# EAGLE design BME280_Breakout (EAGLE 7.1.0)
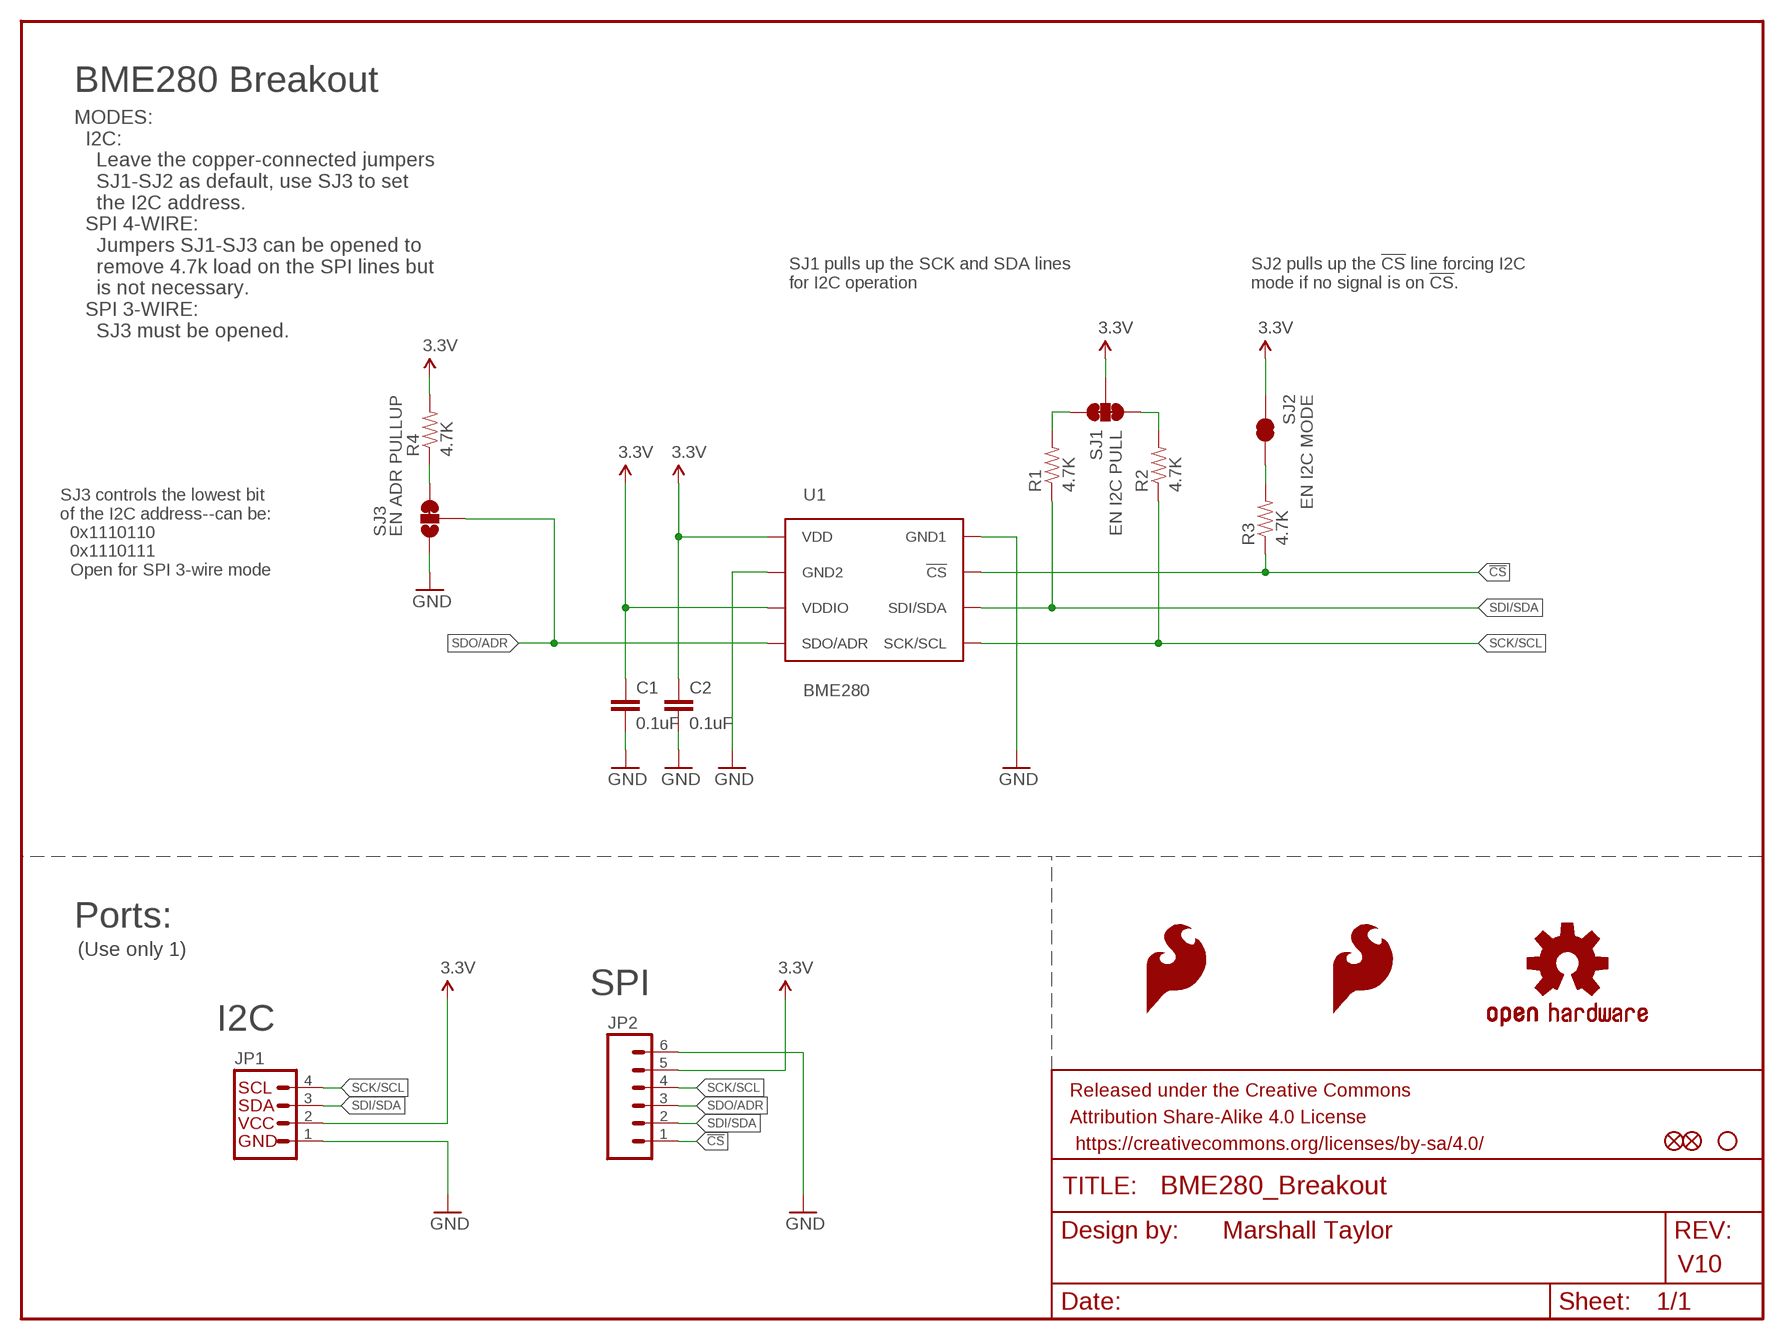
[diagram p0: schematic, sheet 1]

## Parts
C1  0.1uF  0.1UF-25V-5%(0603)  [0603-CAP]
C2  0.1uF  0.1UF-25V-5%(0603)  [0603-CAP]
FID1  FIDUCIAL1X2  [FIDUCIAL-1X2]
FID2  FIDUCIAL1X2  [FIDUCIAL-1X2]
FRAME1  FRAME-LETTER  [CREATIVE_COMMONS]
JP1  I2C_STANDARD_NO_SILK  [1X04_NO_SILK]
JP2  M06NO_SILK_FEMALE_PTH  [1X06_NO_SILK]
LOGO1  SFE_LOGO_FLAME.1_INCH  [SFE_LOGO_FLAME_.1]
LOGO2  SFE_LOGO_FLAME.1_INCH  [SFE_LOGO_FLAME_.1]
LOGO3  OSHW-LOGOS  [OSHW-LOGO-S]
R1  4.7K  4.7KOHM-1/10W-1%(0603)  [0603-RES]
R2  4.7K  4.7KOHM-1/10W-1%(0603)  [0603-RES]
R3  4.7K  4.7KOHM-1/10W-1%(0603)  [0603-RES]
R4  4.7K  4.7KOHM-1/10W-1%(0603)  [0603-RES]
SJ1  EN I2C PULL  JUMPER-PAD-3-NC_BY_TRACE  [PAD-JUMPER-3-3OF3_NC_BY_TRACE_YES_SILK_FULL_BOX]
SJ2  EN I2C MODE  JUMPER-PAD-2-NC_BY_TRACE  [PAD-JUMPER-2-NC_BY_TRACE_YES_SILK]
SJ3  EN ADR PULLUP  JUMPER-PAD-3-2OF3_NC_BY_TRACE_SMALL  [PAD-JUMPER-3-2OF3_NC_BY_TRACE_YES_SILK_FULL_BOX]
STANDOFF4  STAND-OFF  [STAND-OFF]
U1  BME280  [BME280_LGA]

## Nets
3.3V: C1.1 C2.1 JP1.2 JP2.5 R4.2 SJ1.2 SJ2.2 U1.P$6(VDDIO) U1.P$8(VDD)
!CS: JP2.1 R3.1 U1.P$2(!CS)
GND: C1.2 C2.2 JP1.1 JP2.6 SJ3.1 U1.P$1(GND1) U1.P$7(GND2)
N$1: R1.2 SJ1.3
N$2: R2.2 SJ1.1
N$3: R3.2 SJ2.1
N$4: R4.1 SJ3.3
SCK/SCL: JP1.4 JP2.4 R2.1 U1.P$4(SCK/SCL)
SDI/SDA: JP1.3 JP2.2 R1.1 U1.P$3(SDI/SDA)
SDO/ADR: JP2.3 SJ3.2 U1.P$5(SDO/ADR)

## Notes on the sheet
- BME280 Breakout
- MODES:
    I2C:
      Leave the copper-connected jumpers
      SJ1-SJ2 as default, use SJ3 to set
      the I2C address.
    SPI 4-WIRE:
      Jumpers SJ1-SJ3 can be opened to 
      remove 4.7k load on the SPI lines but
      is not necessary.
    SPI 3-WIRE:
      SJ3 must be opened.
- SJ1 pulls up the SCK and SDA lines
  for I2C operation
- SJ2 pulls up the !CS! line forcing I2C
  mode if no signal is on !CS!.
- SJ3 controls the lowest bit
  of the I2C address--can be:
    0x1110110
    0x1110111
    Open for SPI 3-wire mode
- Ports:
- (Use only 1)
- SPI
- I2C
- Marshall Taylor
- V10

## Library data of the parts
C1 C2 = SparkFun-Capacitors:0.1UF-25V-5%(0603): CAP-08604; PROD_ID: CAP-08604
FID1 FID2 = SparkFun-Aesthetics:FIDUCIAL: Fiducial Alignment Points Various fiducial points for machine vision alignment.
FRAME1 = SparkFun-Aesthetics:FRAME-LETTER: Schematic Frame Standard 8.5x11 US Letter frame
JP1 = SparkFun-Connectors:I2C_STANDARD: SparkFun has standardized on a pinout for all I2C based sensor breakouts. This pinout allows I2C boards to be plugged directly into the headers on Arduino Uno compatible boards, and to be daisy chained easily.
JP2 = SparkFun-Connectors:M06: Header 6 Standard 6-pin 0.1" header. Use with straight break away headers (SKU : PRT-00116), right angle break away headers (PRT-00553), swiss pins (PRT-00743), machine pins (PRT-00117), and female headers (PRT-00115). Molex polarized connector foot print use with SKU : PRT-08094 with associated crimp pins and housings. NOTES ON THE VARIANTS LOCK and LOCK_LONGPADS... This footprint was designed to help hold the alignment of a through-hole component (i.e. 6-pin header) while soldering it into place. You may notice that each hole has been shifted either up or down by 0.005 of an inch from it's more standard position (which is a perfectly straight line). This slight alteration caused the pins (the squares in the middle) to touch the edges of the holes. Because they are alternating, it causes a "brace" to hold the component in place. 0.005 has proven to be the perfect amount of "off-center" position when using our standard breakaway headers. Although looks a little odd when you look at the bare footprint, once you have a header in there, the alteration is very hard to notice. Also,if you push a header all the way into place, it is covered up entirely on the bottom side. This idea of altering the position of holes to aid alignment will be further integrated into the Sparkfun Library for other footprints. It can help hold any component with 3 or more connection pins.; PROD_ID: CONN-08437
LOGO1 LOGO2 = SparkFun-Aesthetics:SFE_LOGO_FLAME: SFE Logo, flame only This is the SparkFun flame logo. The logo on the schematic will always be the same size; the package variant is the height of the flame. Default layer for the logo on the board is tSilk.
LOGO3 = SparkFun-Aesthetics:OSHW-LOGO: Open Source Hardware Logo This logo indicates the piece of hardware it is found on incorporates a OSHW license and/or adheres to the definition of open source hardware found here: http://freedomdefined.org/OSHW
R1-R4 = SparkFun-Resistors:4.7KOHM-1/10W-1%(0603): RES-07857; PROD_ID: RES-07857
SJ1 = SparkFun-Passives:JUMPER-PAD-3-NC_BY_TRACE
SJ2 = SparkFun-Passives:JUMPER-PAD-2-NC_BY_TRACE
SJ3 = SparkFun-Passives:JUMPER-PAD-3-2OF3_NC_BY_TRACE
STANDOFF4 = SparkFun-Electromechanical:STAND-OFF: #4 Stand Off This is the mechanical footprint for a #4 phillips button head screw. Use the keepout ring to avoid running the screw head into surrounding components. SKU : PRT-00447
U1 = BME280ComponentLibrary:BME280; PROD_ID: IC-13090

## Board
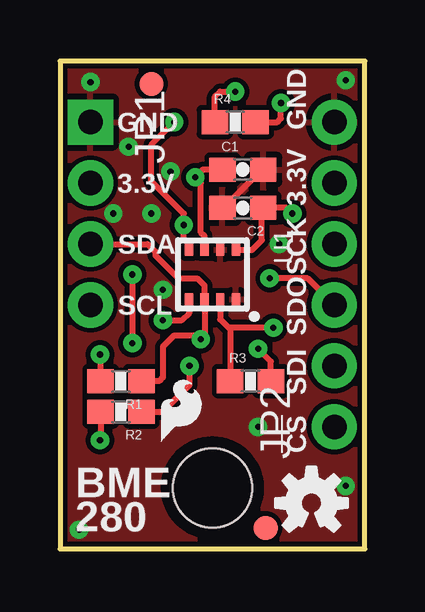
[diagram p1: board, top side]
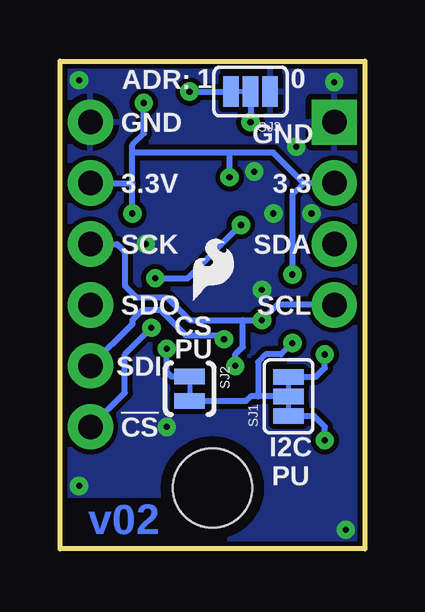
[diagram p2: board, bottom side, seen from below]

Size 12.7 x 20.32 mm. Coordinates in mm from the lower left corner, seen from the top.
Outline: 12.7,20.32 0,20.32 0,0 12.7,0 12.7,20.32
Copper layers (1*16): Top 0.035mm / dielectric 1.5mm / Bottom 0.035mm
Design rules "SparkFun-2-layer": minimum track width 7mil, minimum drill 15mil, track to track 8mil, track to pad 8mil, pad to pad 8mil, via to via 8mil, smd to smd 8mil, copper to edge 8mil, drill to drill 8mil, minimum pad ring 12mil, minimum via ring 10mil, stop-mask expansion 4mil, vias tented up to drill 20mil, thermal gap 10mil

### Footprints (pad centres in the part's own frame; a part is rotated, then mirrored left to right if it is on the bottom)
0603-CAP = smd 1.1 x 1: 1 -0.85,0; 2 0.85,0
FIDUCIAL-1X2 = smd 1 x 1: 1 0,0
1X04_NO_SILK = drill 1.016 pad 1.88 square: 1 0,0 | drill 1.016 pad 1.88: 2 2.54,0; 3 5.08,0; 4 7.62,0
1X06_NO_SILK = drill 1.016 pad 1.88: 1 0,0; 2 2.54,0; 3 5.08,0; 4 7.62,0; 5 10.16,0; 6 12.7,0
0603-RES = smd 1.1 x 1: 1 -0.85,0; 2 0.85,0
PAD-JUMPER-3-3OF3_NC_BY_TRACE_YES_SILK_FULL_BOX = smd 0.635 x 1.27: 1 -0.813,0; 2 0,0; 3 0.813,0
PAD-JUMPER-2-NC_BY_TRACE_YES_SILK = smd 0.635 x 1.27: 1 -0.508,0; 2 0.508,0
PAD-JUMPER-3-2OF3_NC_BY_TRACE_YES_SILK_FULL_BOX = smd 0.635 x 1.27: 1 -0.813,0; 2 0,0; 3 0.813,0
STAND-OFF = hole 3.302: 0,0
BME280_LGA = smd 0.5 x 0.35: P$1 1.025,0.975; P$2 1.025,0.325; P$3 1.025,-0.325; P$4 1.025,-0.975; P$5 -1.025,-0.975; P$6 -1.025,-0.325; P$7 -1.025,0.325; P$8 -1.025,0.975

### Placement (x,y rotation side)
C1  7.62,15.8 0 top
C2  7.62,14.21 180 top
FID1  3.81,19.37 0 top
FID2  8.57,0.87 0 top
FRAME1  -26.67,-22.86 0 top  (outside the outline)
JP1  1.27,17.78 270 top
JP2  11.43,5.08 90 top
LOGO1  7.46,10 0 bottom
LOGO2  3.89,4.13 0 top
LOGO3  10.48,1.91 0 top
R1  2.54,6.99 180 top
R2  2.54,5.71 180 top
R3  7.94,6.99 0 top
R4  7.3,17.78 0 top
SJ1  3.17,6.35 90 bottom
SJ2  7.3,6.67 270 bottom
SJ3  4.76,19.05 180 bottom
STANDOFF4  6.35,2.54 0 top
U1  6.35,11.43 270 top

### Tracks (layer width: path | path; a pad name or v marks a point on that pad's centre or on a via)
3.3V  (via drill 0.25)
  Top 0.254: U1.P$6 6.03,13.03 5.87,13.18 5.87,15.24 v5.64,15.48 5.95,15.8 C1.1 | U1.P$8 8.01,12.46 8.41,12.86 8.41,14.15 C2.1 9.45,14.21 v9.68,13.97 | v3.02,11.43 v3.02,8.57 | R4.2 9.05,17.78 9.21,17.94 v9.21,18.57
  Bottom 0.254: JP1.2 2.54,15.24 | 2.54,15.24 3.81,16.51 5.64,16.51 | 5.64,16.51 9.68,16.51 | v9.68,13.97 9.68,15.24 | 9.68,15.24 9.68,16.51 | 9.68,16.51 9.68,16.83 9.21,17.3 v9.21,18.57 | v5.64,15.48 5.64,16.51 | 2.54,15.24 3.02,14.76 v3.02,11.43 | SJ1.2 4.45,6.35 | 4.45,6.35 4.76,6.35 4.95,6.16 SJ2.2 | v3.02,8.57 3.49,8.1 4.13,8.1 4.45,7.78 4.45,6.35 | JP2.5 9.68,15.24
!CS  (via drill 0.25)
  Top 0.254: v8.89,9.21 7.03,9.21 | U1.P$2 6.67,9.56 7.03,9.21 | 7.03,9.21 7.09,9.15 R3.1
  Bottom 0.254: JP2.1 10,6.51 10,8.1 v8.89,9.21
GND  (via drill 0.25)
  Top 0.254: C2.2 6.83,14.21 8.41,15.8 8.57,15.8
  other vias: 9.13,12.7 2.22,13.97 8.26,5.08 4.29,10.79 11.91,19.53 2.86,16.75 1.27,19.45 3.81,13.97 4.6,15.72 0.79,0.79 11.91,2.62
  pour Top (isolate 0.203): 0,0 12.7,0 12.7,20.32 0,20.32
  pour Bottom (isolate 0.203): 0,20.32 12.7,20.32 12.7,2.26 8.33,2.26 8.33,0 0,0
N$1  (via drill 0.25)
  Top 0.254: v1.67,8.1 1.67,7.01 R1.2
  Bottom 0.254: SJ1.3 2.04,7.16 1.67,7.54 v1.67,8.1
N$2  (via drill 0.25)
  Top 0.254: R2.2 1.69,4.55 v1.67,4.52
  Bottom 0.254: SJ1.1 2.12,5.54 1.67,5.08 v1.67,4.52
N$3  (via drill 0.25)
  Top 0.254: R3.2 8.79,7.8 v8.26,8.33
  Bottom 0.254: SJ2.1 8.05,7.18 8.26,7.38 v8.26,8.33
N$4  (via drill 0.25)
  Top 0.254: R4.1 6.45,18.84 6.67,19.05 v7.3,19.05
  Bottom 0.254: v7.3,19.05 SJ3.3
SCK/SCL  (via drill 0.25)
  Top 0.254: v4.29,9.53 5.08,9.53 5.38,9.82 U1.P$4 | R2.1 4.29,5.71 5.4,6.83 v5.4,7.62
  Bottom 0.254: JP2.4 10.32,12.7 10,12.38 10,10.95 9.53,10.48 8.26,10.48 7.3,9.53 5.08,9.53 | 5.08,9.53 v4.29,9.53 3.65,10.16 JP1.4 | v5.4,7.62 5.4,8.1 5.08,8.41 5.08,9.53
SDI/SDA  (via drill 0.25)
  Top 0.254: JP1.3 3.65,12.7 3.97,12.38 3.97,12.22 4.92,11.27 5.71,11.27 6.03,10.96 U1.P$3 6.03,8.89 v5.87,8.73 5.71,8.89 4.76,8.89 4.29,8.41 4.29,7.14 4.13,6.99 R1.1
  Bottom 0.254: v5.87,8.73 6.03,8.89 7.46,8.89 8.53,9.96 9.25,9.96 9.68,9.53 9.68,9.37 JP2.2
SDO/ADR  (via drill 0.25)
  Top 0.254: U1.P$5 5.38,12.72 5.16,12.94 v5.16,13.49 5.16,13.97 3.81,15.32 3.81,16.83 v4.76,17.78 | JP2.3 10.32,11.27 v8.73,11.27
  Bottom 0.254: v8.73,11.27 7.38,11.27 v5.16,13.49 | SJ3.2 4.92,18.89 4.76,18.73 v4.76,17.78

### Text on the board
Bottom: v02
tPlace: GND | GND | 3.3V | 3.3V | SCK | SDA | SCL | SDO | SDI | !CS | BME / 280
bPlace: 0 | 1 | ADR: | GND | GND | 3.3 | 3.3V | SDA | SCK | SCL | SDO | CS / PU | SDI | !CS | I2C / PU
Measures: Units in inches
tDocu: Marshall Taylor | Note: Top and bottom ground planes must be isolated / no more than 0.008 inch to allow proper grounding.